# Altium schematic sheet USB2BT.SchDoc
size A4
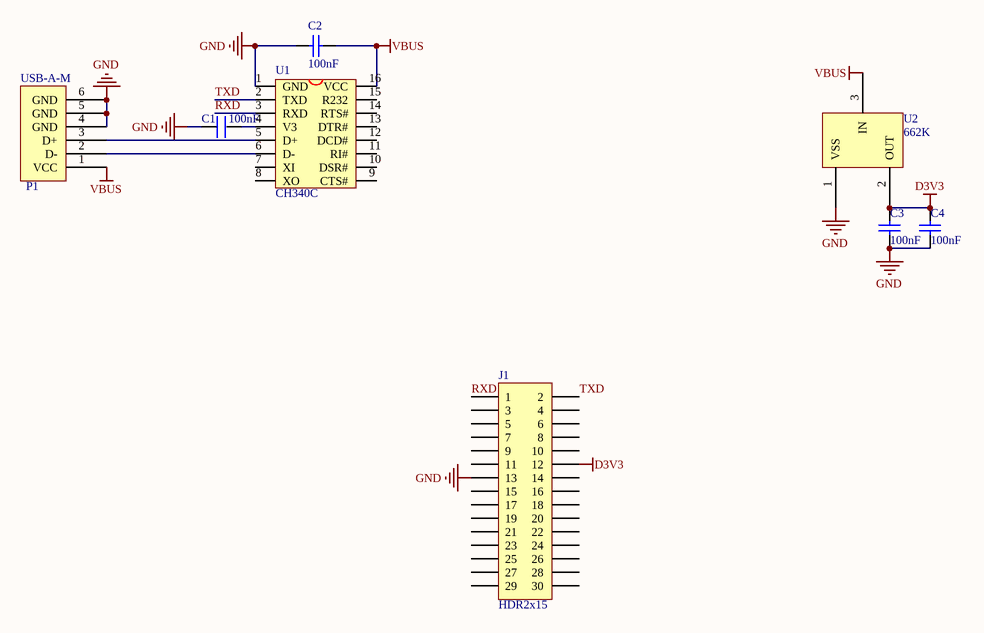
[diagram p0: USB2BT.SchDoc]

## Parts
C1  100nF  [0603C]
C2  100nF  [0603C]
C3  100nF  [0603C]
C4  100nF  [0603C]
J1  HDR2x15  [HC-05/06/08V15]
P1  USB-A-M  [USB-A-M]
U1  CH340C  [SO-16]
U2  662K  [SOT-23]

## Nets
D3V3: C3.2 C4.2 J1.12 U2.2(OUT)
GND: C1.1 C2.1 C3.1 C4.1 J1.13 P1.4(GND) P1.5(GND) P1.6(GND) U1.1(GND) U2.1(VSS)
VBUS: C2.2 P1.1(VCC) U1.16(VCC) U2.3(IN)
RXD: J1.1 U1.3(RXD)
TXD: J1.2 U1.2(TXD)
NetC1_2: C1.2 U1.4(V3)
NetP1_2: P1.2(D-) U1.6(D-)
NetP1_3: P1.3(D+) U1.5(D+)

Not connected (* = marked no-connect by the designer): J1 3 4 5 6 7 8 9 10 11 14 15 16 17 18 19 20 21 22 23 24 25 26 27 28 29 30; U1 7(XI) 8(XO) 9(CTS#) 10(DSR#) 11(RI#) 12(DCD#) 13(DTR#) 14(RTS#) 15(R232)

## Library data of the parts
C1 = C
C2-C4 = Cap: Capacitor; Published: 8-Jun-2000; LatestRevisionDate: 17-Jul-2002; LatestRevisionNote: Re-released for DXP Platform.; PackageReference: RAD-0.3; Publisher: Altium Limited; Value: 100nF
J1 = HDR2x15: Connector
P1 = USB-B
U1 = CH340G: USB2UART